# EAGLE design FAN-plus-SHIM (EAGLE 9.6.2)
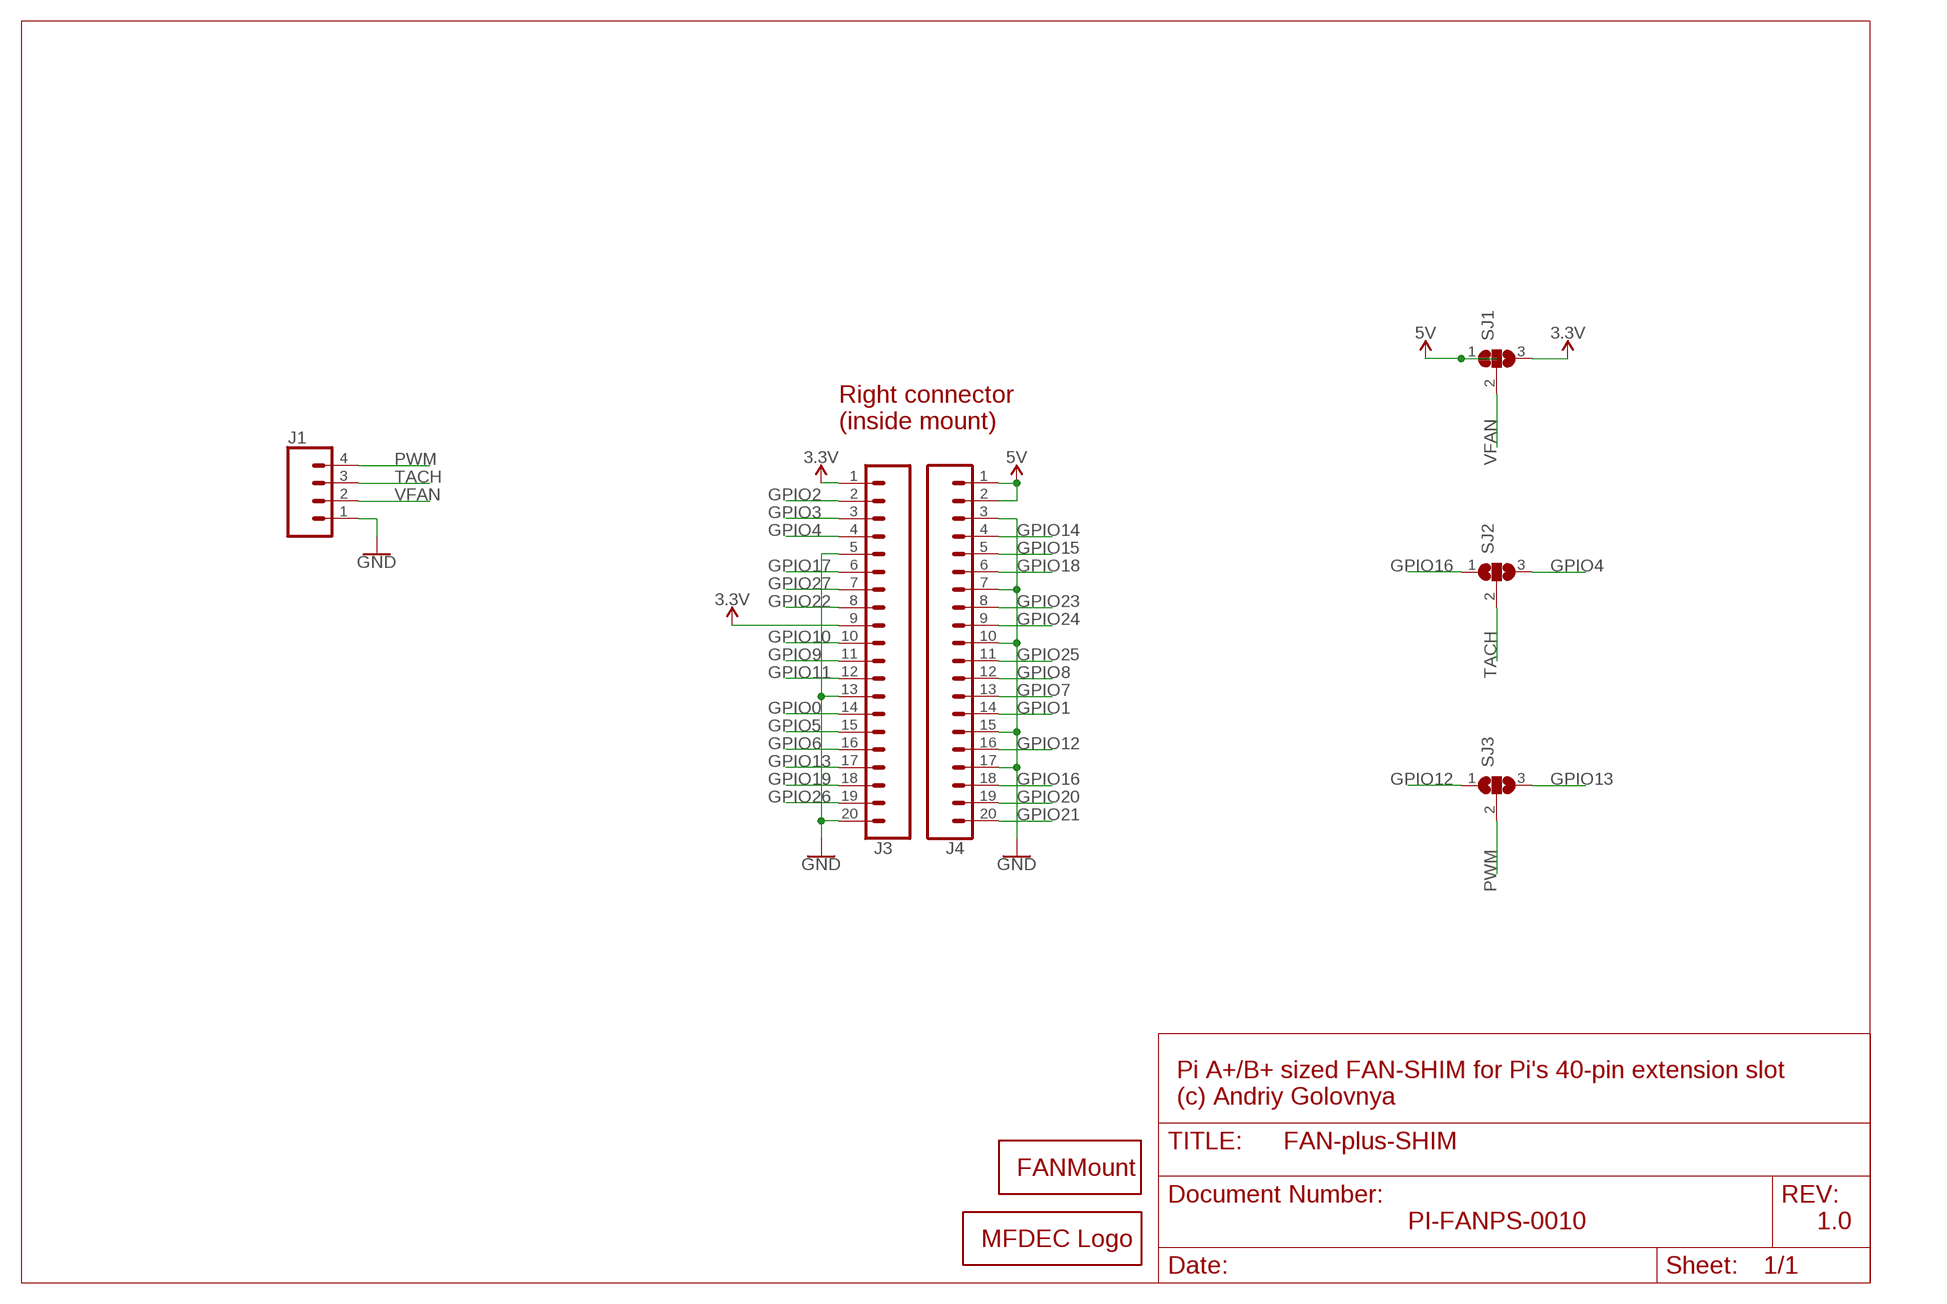
[diagram p0: schematic, sheet 1]

## Parts
FAN1  FAN40HO  [FAN40HO]
J1  CONN_04  [1X04]
J3  CONN_20LOCK  [1X20_LOCK]
J4  CONN_20LOCK  [1X20_LOCK]
LOGO1  MFDECLOGO_L_40MM  [MFDEC_L_40MM]
SJ1  SJ2  [SJ_2]
SJ2  SJ2  [SJ_2]
SJ3  SJ2  [SJ_2]

## Nets
3.3V: J3.1 J3.9 SJ1.3
5V: J4.1 J4.2 SJ1.1
GND: J1.1 J3.5 J3.13 J3.20 J4.3 J4.7 J4.10 J4.15 J4.17
GPIO0: J3.14
GPIO1: J4.14
GPIO2: J3.2
GPIO3: J3.3
GPIO4: J3.4 SJ2.3
GPIO5: J3.15
GPIO6: J3.16
GPIO7: J4.13
GPIO8: J4.12
GPIO9: J3.11
GPIO10: J3.10
GPIO11: J3.12
GPIO12: J4.16 SJ3.1
GPIO13: J3.17 SJ3.3
GPIO14: J4.4
GPIO15: J4.5
GPIO16: J4.18 SJ2.1
GPIO17: J3.6
GPIO18: J4.6
GPIO19: J3.18
GPIO20: J4.19
GPIO21: J4.20
GPIO22: J3.8
GPIO23: J4.8
GPIO24: J4.9
GPIO25: J4.11
GPIO26: J3.19
GPIO27: J3.7
PWM: J1.4 SJ3.2
TACH: J1.3 SJ2.2
VFAN: J1.2 SJ1.2

## Notes on the sheet
- Right connector
  (inside mount)
- Pi A+/B+ sized FAN-SHIM for Pi's 40-pin extension slot
  (c) Andriy Golovnya
- PI-FANPS-0010 | 1.0

## Library data of the parts
FAN1 = _my_fans:FAN: 30mm and 40mm fan mount holes
J1 = SparkFun-Connectors:CONN_04: Multi connection point. Often used as Generic Header-pin footprint for 0.1 inch spaced/style header connections On any of the 0.1 inch spaced packages, you can populate with these: Break Away Headers - Straight <https://www.sparkfun.com/products/116> (PRT-00116) Break Away Male Headers - Right Angle <https://www.sparkfun.com/products/553> (PRT-00553) Female Headers <https://www.sparkfun.com/products/115> (PRT-00115) Break Away Headers - Machine Pin <https://www.sparkfun.com/products/117> (PRT-00117) Break Away Female Headers - Swiss Machine Pin <https://www.sparkfun.com/products/743> (PRT-00743) For SCREWTERMINALS and SPRING TERMINALS visit here: Screw Terimnals on SparkFun.com <https://www.sparkfun.com/search/results?term=Screw+Terminals> (5mm/3.5mm/2.54mm spacing) This device is also useful as a general connection point to wire up your design to another part of your project. Our various solder wires solder well into these plated through hole pads. Hook-Up Wire - Assortment (Stranded, 22 AWG) <https://www.sparkfun.com/products/11375> (PRT-11375) Hook-Up Wire - Assortment (Solid Core, 22 AWG) <https://www.sparkfun.com/products/11367> (PRT-11367) View the entire wire category on our website here <https://www.sparkfun.com/categories/141> Special notes: Molex polarized connector foot print use with SKU : PRT-08231 with associated crimp pins and housings. 1MM SMD Version SKU: PRT-10208; PROD_ID: CONN-09696
J3 J4 = _my_locked_connectors:CONN_20: Multi connection point. Often used as Generic Header-pin footprint for 0.1 inch spaced/style header connections On any of the 0.1 inch spaced packages, you can populate with these: Break Away Headers - Straight <https://www.sparkfun.com/products/116> (PRT-00116) Break Away Male Headers - Right Angle <https://www.sparkfun.com/products/553> (PRT-00553) Female Headers <https://www.sparkfun.com/products/115> (PRT-00115) Break Away Headers - Machine Pin <https://www.sparkfun.com/products/117> (PRT-00117) Break Away Female Headers - Swiss Machine Pin <https://www.sparkfun.com/products/743> (PRT-00743) For SCREWTERMINALS and SPRING TERMINALS visit here: Screw Terimnals on SparkFun.com <https://www.sparkfun.com/search/results?term=Screw+Terminals> (5mm/3.5mm/2.54mm spacing) This device is also useful as a general connection point to wire up your design to another part of your project. Our various solder wires solder well into these plated through hole pads. Hook-Up Wire - Assortment (Stranded, 22 AWG) <https://www.sparkfun.com/products/11375> (PRT-11375) Hook-Up Wire - Assortment (Solid Core, 22 AWG) <https://www.sparkfun.com/products/11367> (PRT-11367) View the entire wire category on our website here <https://www.sparkfun.com/categories/141> Special notes: Molex polarized connector foot print use with SKU : PRT-08231 with associated crimp pins and housings. 1MM SMD Version SKU: PRT-10208 NOTES ON THE VARIANTS LOCK and LOCK_LONGPADS... This footprint was designed to help hold the alignment of a through-hole component (i.e. 6-pin header) while soldering it into place. You may notice that each hole has been shifted either up or down by 0.005 of an inch from it's more standard position (which is a perfectly straight line). This slight alteration caused the pins (the squares in the middle) to touch the edges of the holes. Because they are alternating, it causes a "brace" to hold the component in place. 0.005 has proven to be the perfect amount of "off-center" position when using our standard breakaway headers. Although looks a little odd when you look at the bare footprint, once you have a header in there, the alteration is very hard to notice. Also,if you push a header all the way into place, it is covered up entirely on the bottom side. Note about LOCK SPECIAL package: This is just like the LOCK variant in that the holes are staggared by 5 mil, but except for the last two holes. They are not altered from the "standard" footprint layout. This is used for a special purpose on the layout of our Graphic LCD Backpack. Make sure you want to use this device before selecting it for you project!
LOGO1 = _my_logos:MFDECLOGO: Midnight Fog - Digital Eye Candy LOGO
SJ1-SJ3 = _my_jumpers:SJ2: SMD solder JUMPER SJ2 - simple jumper SJ2FI - fancy inside jumper SJ2FO - fancy outside jumper SJ2FL - fancy left jumper SJ2FR - fancy right jumper SJ2W - wide jumper

## Board
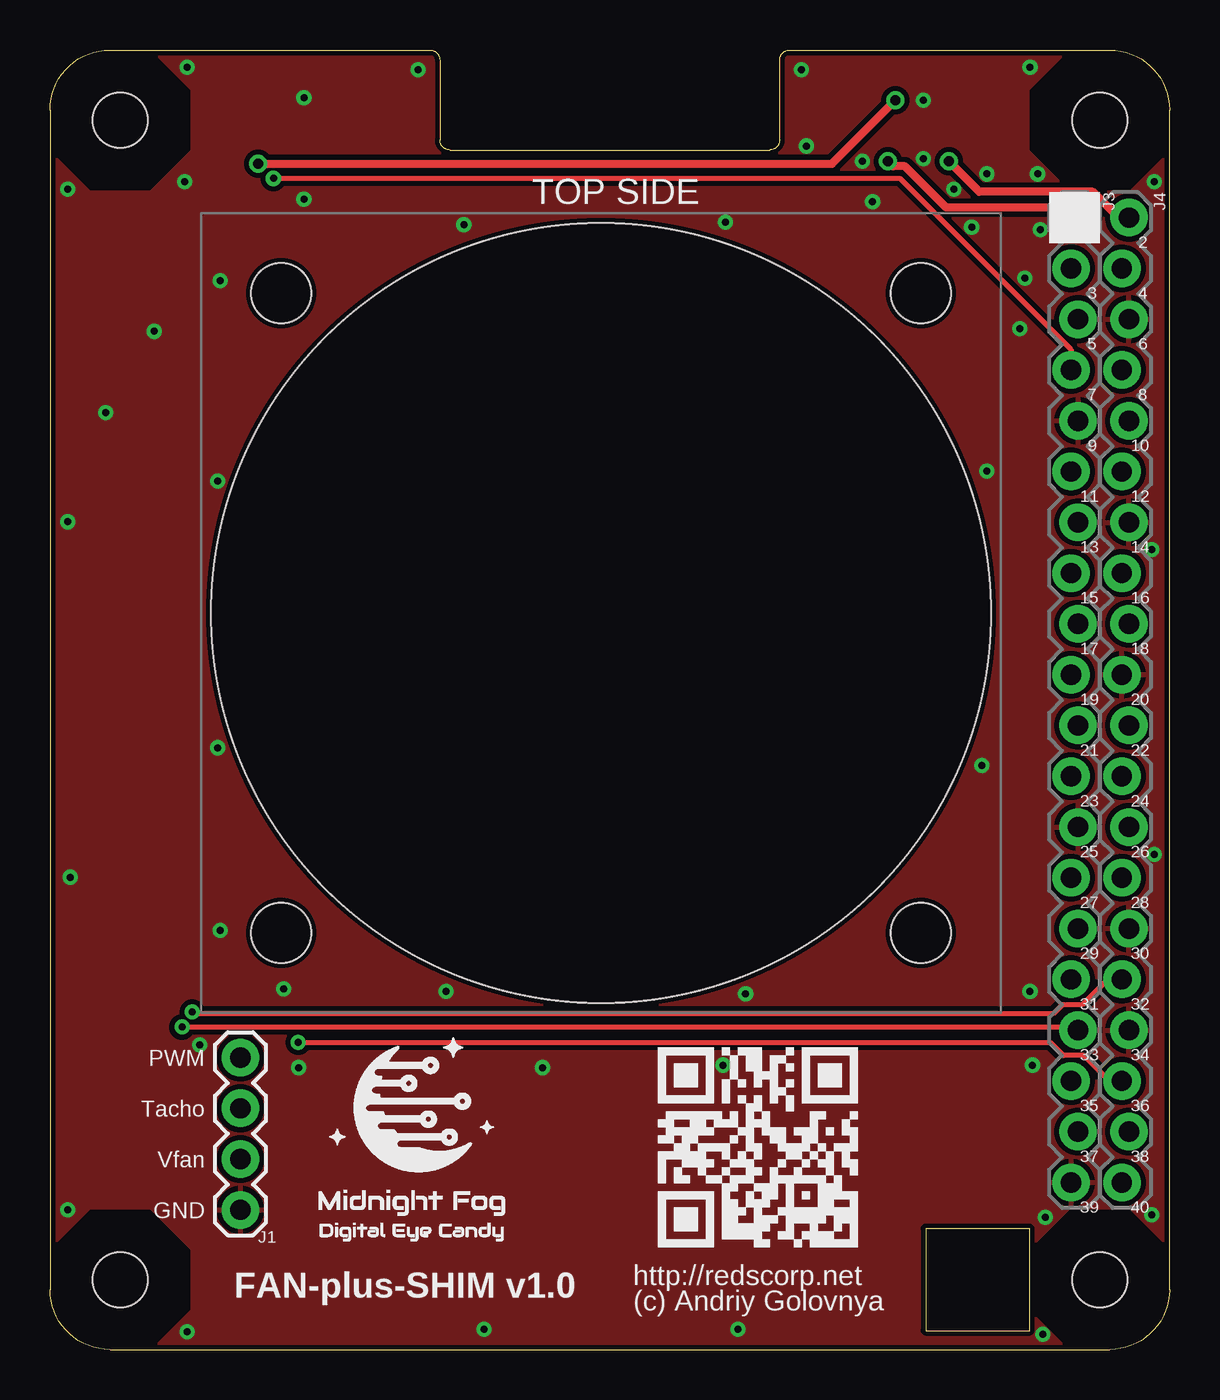
[diagram p1: board, top side]
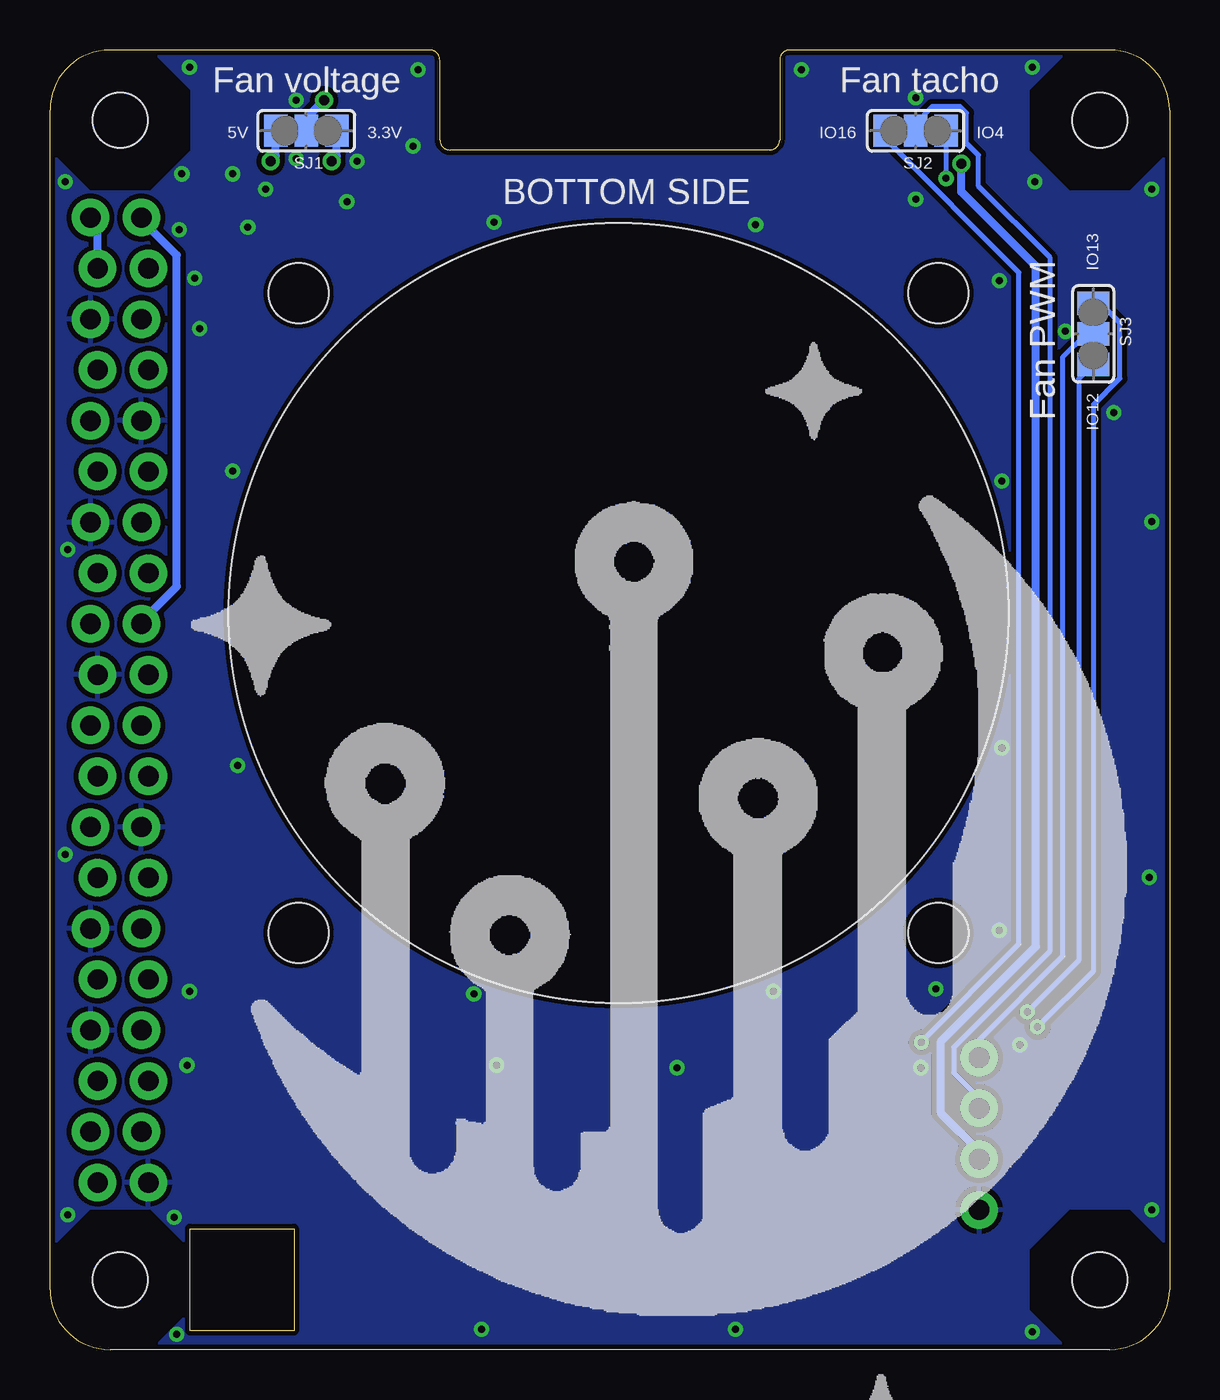
[diagram p2: board, bottom side, seen from below]

Size 56 x 65 mm. Coordinates in mm from the lower left corner, seen from the top.
Outline: 3,0 53,0 arc90 56,3 56,62 arc90 53,65 37,65 arc90 36.5,64.5 36.5,60.5 arc-90 36,60 20,60 arc-90 19.5,60.5 19.5,64.5 arc90 19,65 3,65 arc90 0,62 0,3 arc90 3,0
Outline: 43.8,0.95 49,0.95 49,6.05 43.8,6.05 43.8,0.95
Copper layers (1*16): Top 0.035mm / dielectric 1.5mm / Bottom 0.035mm
Design rules "default *": minimum track width 6mil, minimum drill 0.35mm, track to track 6mil, track to pad 6mil, pad to pad 6mil, via to via 6mil, smd to smd 6mil, copper to edge 6mil, drill to drill 6mil, minimum pad ring 10mil, minimum via ring 8mil, stop-mask expansion 4mil, vias tented up to drill 20mil, thermal gap 10mil
Holes 2.75 mm at 3.5,3.5 52.5,3.5 3.5,61.5 52.5,61.5

### Footprints (pad centres in the part's own frame; a part is rotated, then mirrored left to right if it is on the bottom)
FAN40HO = hole 3: -16,16; 16,16; -16,-16; 16,-16 | hole 39: 0,0
1X04 = drill 1.016 pad 1.88: 1 0,0; 2 2.54,0; 3 5.08,0; 4 7.62,0
1X20_LOCK = drill 1.016 pad 1.88: 1 0,0.178; 2 2.54,-0.178; 3 5.08,0.178; 4 7.62,-0.178; 5 10.16,0.178; 6 12.7,-0.178; 7 15.24,0.178; 8 17.78,-0.178; 9 20.32,0.178; 10 22.86,-0.178; 11 25.4,0.178; 12 27.94,-0.178; 13 30.48,0.178; 14 33.02,-0.178; 15 35.56,0.178; 16 38.1,-0.178; 17 40.64,0.178; 18 43.18,-0.178; 19 45.72,0.178; 20 48.26,-0.178
SJ_2 = smd 1.168 x 1.6: 1 -1.524,0; 2 0,0; 3 1.524,0

### Placement (x,y rotation side)
FAN1  27.56,36.83 0 top
J1  9.53,6.99 90 top
J3  51.25,56.62 270 top
J4  53.79,56.62 270 top
LOGO1  -1.52,-10.03 90 bottom  (outside the outline)
LOGO2  MFDECLOGO_SQ_8MM  [MFDEC_SQ_8MM]  12.75,5.11 0 top
LOGO3  RSNURL_QR_10MM  [RSNURL_QR_10MM]  30.43,5.11 0 top
SJ1  43.18,60.96 0 bottom
SJ2  12.7,60.96 0 bottom
SJ3  3.81,50.8 90 bottom

### Tracks (layer width: path | path; a pad name or v marks a point on that pad's centre or on a via)
3.3V  (via drill 0.5)
  Top 0.406: J3.1 50.92,57.12 44.83,57.12 42.77,59.18 42.16,59.18 v41.91,59.44
  Bottom 0.406: J3.9 51.43,36.39 49.65,38.17 49.65,54.74 51.43,56.52 J3.1 | v41.91,59.44 41.66,59.69 SJ1.3
5V  (via drill 0.5)
  Top 0.406: J4.1 53.46,56.62 52.17,57.91 46.48,57.91 v44.96,59.44
  Bottom 0.406: J4.2 53.62,56.26 J4.1 | v44.96,59.44 44.7,59.69 SJ1.1
GND  (via drill 0.35)
  other vias: 43.69,59.56 49.4,58.8 49.02,64.14 37.59,64.01 37.85,60.2 40.64,59.44 6.86,64.14 18.41,64.01 0.89,58.04 12.7,57.53 8.51,53.47 6.73,58.42 12.7,62.61 0.89,6.99 6.86,0.89 49.66,0.76 49.78,6.6 55.12,6.73 1.02,23.62 0.89,41.4 34.42,1.02 21.72,1.02 19.81,17.91 34.8,17.78 11.68,18.03 8.51,20.95 8.38,30.1 8.38,43.43 20.7,56.26 33.78,56.39 46.1,56.13 49.53,56.01 48.77,53.59 48.51,51.05 41.15,57.4 46.86,43.94 46.61,29.21 55.24,58.42 55.24,24.77 55.12,40.01 49.02,17.91 49.15,14.22 12.45,14.1 7.49,15.24 33.66,14.22 24.64,14.1 5.21,50.93 2.79,46.86 45.21,58.04 46.86,58.8 43.69,62.48
  pour Top (isolate 0.254): -0.04,0 -0.04,65.15 56.23,65.15 56.23,0
  pour Bottom (isolate 0.254): -0.04,0 -0.04,65.15 56.23,65.15 56.23,0
GND1
  cutout Top: 0,5 2,7 5,7 7,5 7,2 5,0 0,0
  cutout Bottom: 0,0 0,5 2,7 5,7 7,5 7,2 5,0
  cutout Top: 56,0 51,0 49,2 49,5 51,7 54,7 56,5
  cutout Bottom: 56,0 51,0 49,2 49,5 51,7 54,7 56,5
  cutout Top: 0,65 5,65 7,63 7,60 5,58 2,58 0,60
  cutout Bottom: 0,65 5,65 7,63 7,60 5,58 2,58 0,60
  cutout Top: 56,65 51,65 49,63 49,60 51,58 54,58 56,60
  cutout Bottom: 56,65 51,65 49,63 49,60 51,58 54,58 56,60
GPIO4  (via drill 0.35)
  Top 0.254: v11.18,58.58 42.51,58.58 51.08,50.01 J3.4
  Bottom 0.254: SJ2.3 v11.18,58.58
GPIO12  (via drill 0.35)
  Top 0.254: J4.16 52.9,18.52 51.63,17.25 50.63,17.25 50.18,16.8 7.21,16.8 v7.11,16.89
  Bottom 0.254: v7.11,16.89 4.55,19.46 4.55,48.54 SJ3.1
GPIO13  (via drill 0.35)
  Top 0.254: J3.17 51.3,16.1 6.63,16.1 v6.6,16.13
  Bottom 0.254: SJ3.3 3.43,52.32 2.48,51.37 2.48,48.58 3.81,47.24 3.81,18.92 v6.6,16.13
GPIO16  (via drill 0.35)
  Top 0.254: J4.18 53.49,13.56 52.85,13.56 51.71,14.71 50.7,14.71 50.06,15.34 12.45,15.34 v12.42,15.37
  Bottom 0.254: v12.42,15.37 12.42,15.39 7.53,20.29 7.53,53.87 14.21,60.56 14.21,60.84 14.22,60.85 SJ2.1
PWM
  Bottom 0.254: J1.4 9.53,15.49 5.33,19.68 5.33,49.66 4.19,50.8 SJ3.2
TACH
  Bottom 0.254: J1.3 9.53,12.57 10.79,13.84 10.79,15.11 5.97,19.94 5.97,54.61 9.55,58.2 9.55,59.74 10.16,60.34 10.16,61.85 10.48,62.17 11.88,62.17 12.7,61.34 SJ2.2
VFAN  (via drill 0.5)
  Top 0.406: v42.29,62.48 39.12,59.31 v10.41,59.31
  Bottom 0.406: J1.2 9.53,9.91 11.43,11.81 11.43,15.41 6.69,20.16 6.69,54.19 10.41,57.91 v10.41,59.31 | SJ1.2 43.18,61.59 v42.29,62.48

### Text on the board
tPlace: TOP SIDE | 2 | 3 | 4 | 5 | 6 | 7 | 8 | 9 | 10 | 11 | 12 | 13 | 14 | 15 | 16 | 17 | 18 | 19 | 20 | 21 | 22 | 23 | 24 | 25 | 26 | 27 | 28 | 29 | 30 | 31 | 32 | PWM | 33 | 34 | Tacho | 35 | 36 | Vfan | 37 | 38 | GND | 39 | 40 | FAN-plus-SHIM v1.0 | http://redscorp.net | (c) Andriy Golovnya
bPlace: Fan tacho | Fan voltage | IO4 | IO16 | 3.3V | 5V | BOTTOM SIDE | IO13 | Fan PWM | IO12